# EAGLE schematic esquema (EAGLE 9.6.2)
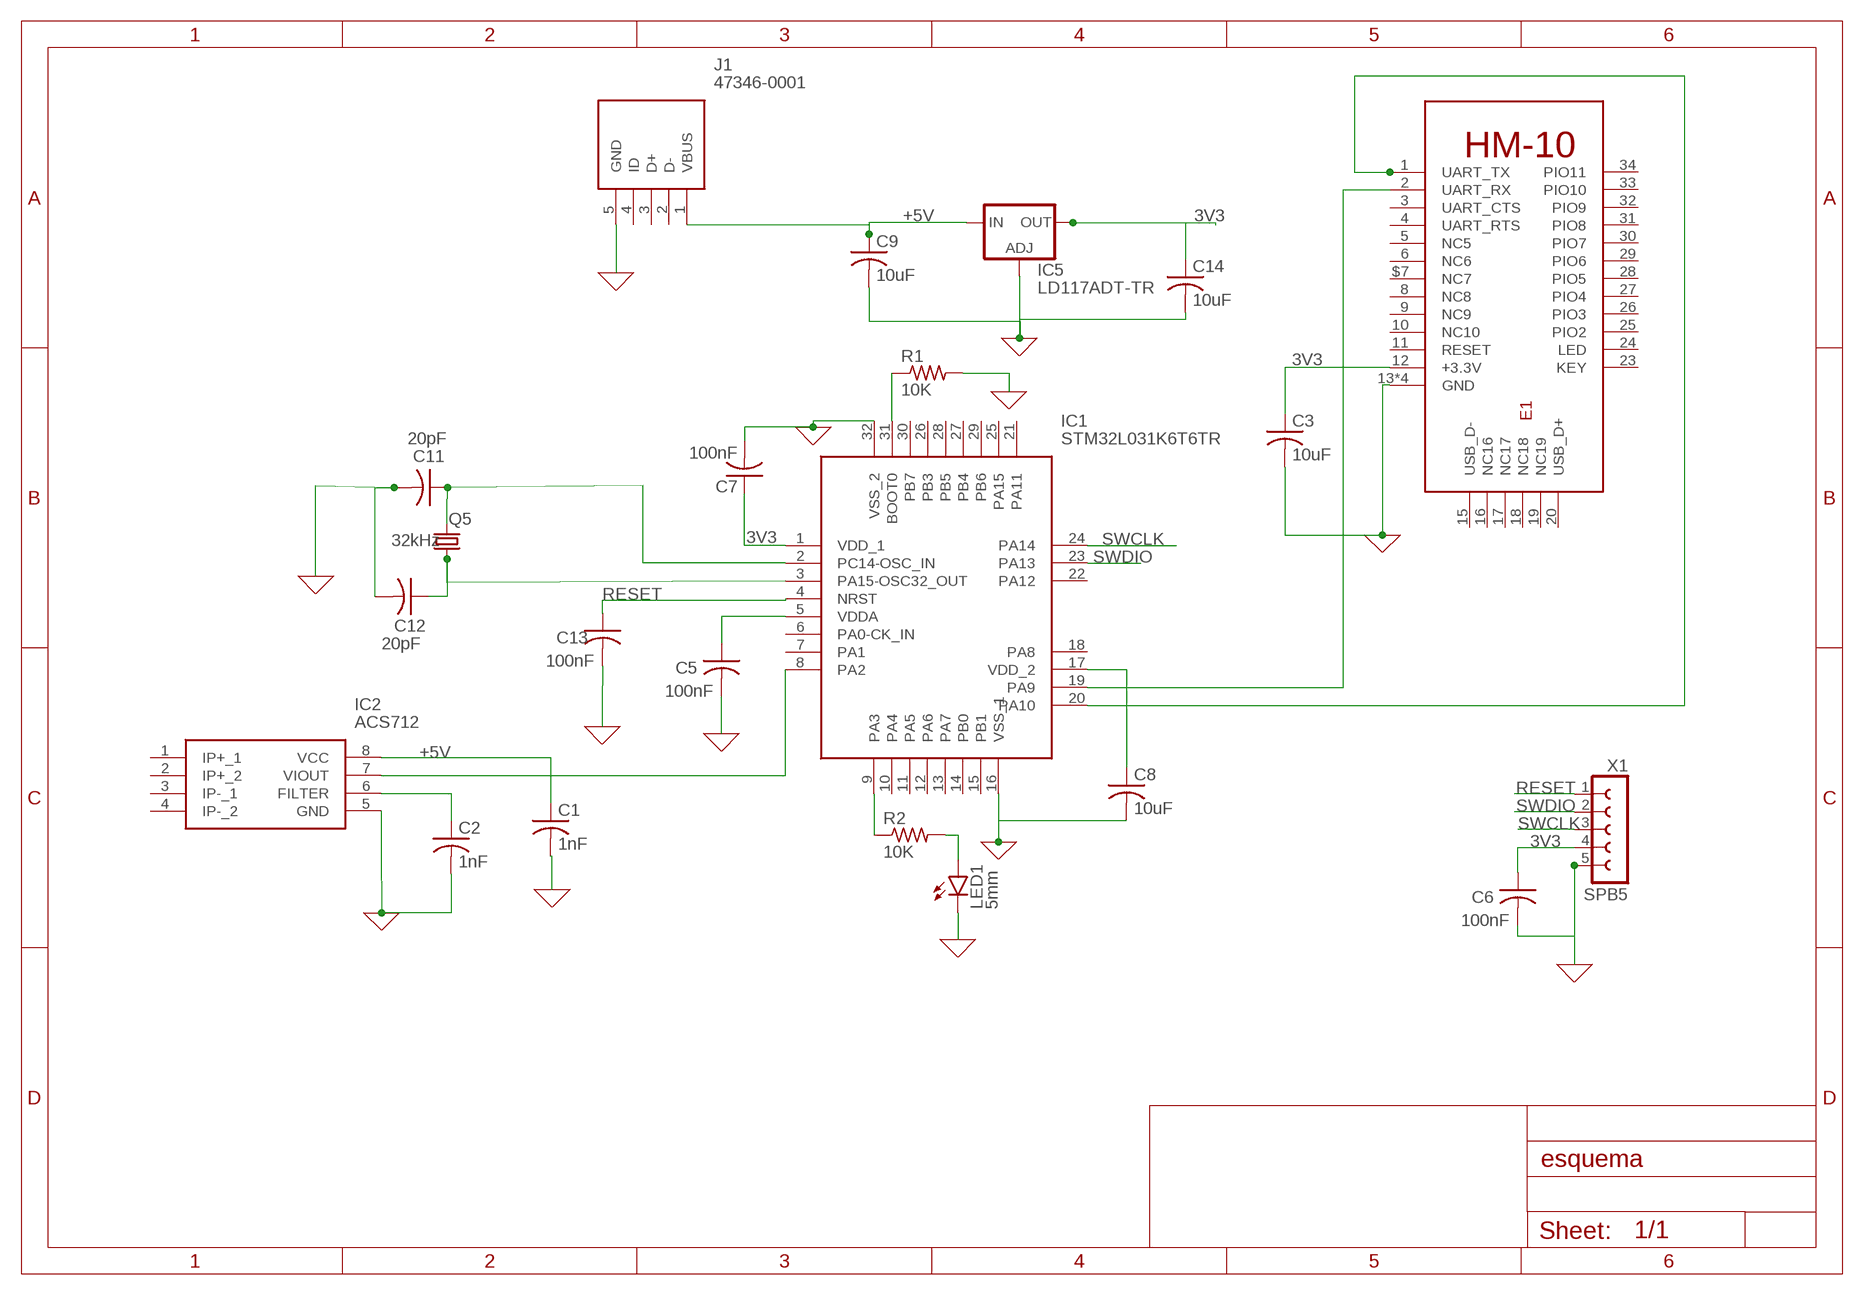
[diagram p0: schematic, sheet 1]

## Parts
C1  1nF  C-USC0805  [C0805]
C2  1nF  C-USC0805  [C0805]
C3  10uF  C-USC0805  [C0805]
C5  100nF  C-USC0805  [C0805]
C6  100nF  C-USC0805  [C0805]
C7  100nF  C-USC0805  [C0805]
C8  10uF  C-USC0805  [C0805]
C9  10uF  C-USC0805  [C0805]
C11  20pF  C-USC0805  [C0805]
C12  20pF  C-USC0805  [C0805]
C13  100nF  C-USC0805  [C0805]
C14  10uF  C-USC0805  [C0805]
E1  HM-10-BOARD  [26.9X13X2.2_BOARD]
IC1  STM32L031K6T6TR  [QFP80P900X900X160-32N]
IC2  ACS712  [SOIC127P600X175-8N]
IC5  LD117ADT-TR  [DPACK]
J1  47346-0001  [47346-0001]
LED1  5mm  LED5MM  [LED5MM]
Q5  32kHz  CRYSTALHC49S  [HC49/S]
R1  10K  R-US_1812X7R  [1812X7R]
R2  10K  R-US_1812X7R  [1812X7R]
X1  SPB5  [SPB5]

## Nets
0: C1.2 C2.2 C3.2 C5.2 C6.2 C7.2 C8.2 C9.2 C11.2 C12.2 C13.2 C14.2 E1.13(GND) E1.14(GND) E1.21(GND) E1.22(GND) IC1.16(VSS_1) IC1.32(VSS_2) IC2.5(GND) IC5.1(ADJ) J1.5(GND) LED1.K(C) R1.2 X1.5 ; supply symbol labelled GND
3V3: C14.1 IC5.4(OUT)
+5V: C9.1 IC5.3(IN) J1.1(VBUS)
N$1: IC1.8(PA2) IC2.7(VIOUT)
N$2: C11.1 IC1.2(PC14-OSC_IN) Q5.2
N$3: IC1.31(BOOT0) R1.1
N$4: C1.1 IC2.8(VCC)
N$5: C12.1 IC1.3(PA15-OSC32_OUT) Q5.1
N$6: IC1.23(PA13)
N$7: E1.2(UART_RX) IC1.19(PA9)
N$8: C13.1 IC1.4(NRST)
N$9: C2.1 IC2.6(FILTER)
N$10: C3.1 E1.12(+3.3V)
N$11: IC1.9(PA3) R2.1
N$12: C7.1 IC1.1(VDD_1)
N$13: C6.1 X1.4
N$14: C8.1 IC1.17(VDD_2)
N$15: LED1.A R2.2
N$16: C5.1 IC1.5(VDDA)
N$17: E1.1(UART_TX) IC1.20(PA10)
N$18: IC1.24(PA14)
RESET: X1.1
SWCLK: X1.3
SWDIO: X1.2
Unconnected: E1.3(UART_CTS) E1.4(UART_RTS) E1.5(NC5) E1.6(NC6) E1.8(NC8) E1.9(NC9) E1.10(NC10) E1.11(RESET) E1.15(USB_D-) E1.16(NC16) E1.17(NC17) E1.18(NC18) E1.19(NC19) E1.20(USB_D+) E1.23(KEY) E1.24(LED) E1.25(PIO2) E1.26(PIO3) E1.27(PIO4) E1.28(PIO5) E1.29(PIO6) E1.30(PIO7) E1.31(PIO8) E1.32(PIO9) E1.33(PIO10) E1.34(PIO11) E1.$7(NC7) IC1.6(PA0-CK_IN) IC1.7(PA1) IC1.10(PA4) IC1.11(PA5) IC1.12(PA6) IC1.13(PA7) IC1.14(PB0) IC1.15(PB1) IC1.18(PA8) IC1.21(PA11) IC1.22(PA12) IC1.25(PA15) IC1.26(PB3) IC1.27(PB4) IC1.28(PB5) IC1.29(PB6) IC1.30(PB7) IC2.1(IP+_1) IC2.2(IP+_2) IC2.3(IP-_1) IC2.4(IP-_2) J1.2(D-) J1.3(D+) J1.4(ID)

## Library data of the parts
C1-C3 C5-C9 C11-C14 = rcl:C-US: CAPACITOR, American symbol; SPICEPREFIX: C
E1 = hm10:HM-10: HM Bluetooth module use TI CC2540 or CC2541, Master and slave roles in one, transmission version and remote control version and PIO state acquisition functions in one, Support the AT command modify module parameters, Convenient and flexible.
IC1 = STM32L031K6T6TR:STM32L031K6T6TR: STMICROELECTRONICS - STM32L031K6T6TR - ARM MCU, STM32 Family STM32L0 Series Microcontrollers, ARM Cortex-M0+, 32bit, 32 MHz, 32 KB, 8 KB Source: Datasheet <https://4donline.ihs.com/images/VipMasterIC/IC/SGST/SGST-S-A0002219924/SGST-S-A0002219924-1.pdf?hkey=6D3A4C79FDBF58556ACFDE234799DDF0>; ARROW_PART_NUMBER: STM32L031K6T6TR; ARROW_PRICE-STOCK: https://www.arrow.com/en/products/stm32l031k6t6tr/stmicroelectronics; DESCRIPTION: STMICROELECTRONICS - STM32L031K6T6TR - ARM MCU, STM32 Family STM32L0 Series Microcontrollers, ARM Cortex-M0+, 32bit, 32 MHz, 32 KB, 8 KB; HEIGHT: 1.6mm; MANUFACTURER_NAME: STMicroelectronics; MANUFACTURER_PART_NUMBER: STM32L031K6T6TR; MOUSER_PART_NUMBER: 511-STM32L031K6T6TR; MOUSER_PRICE-STOCK: https://www.mouser.co.uk/ProductDetail/STMicroelectronics/STM32L031K6T6TR/?qs=xwQlLnDx56Cmxri8cgW0QQ%3D%3D
IC2 = ACS712:ACS712: Fully Integrated, Hall Effect-Based Linear Current Sensor IC with 2.1 kVRMS Isolation and a Low-Resistance Current Conductor Source: Datasheet <https://www.allegromicro.com/~/media/files/datasheets/acs712-datasheet.ashx>; DESCRIPTION: Fully Integrated, Hall Effect-Based Linear Current Sensor IC with 2.1 kVRMS Isolation and a Low-Resistance Current Conductor; HEIGHT: 1.75mm; MANUFACTURER_NAME: Allegro Microsystems; MANUFACTURER_PART_NUMBER: ACS712
IC5 = v-reg:LD117A?*: Low drop fixed and adjustable positive voltage regulators 1 A Source: http://www.st.com/stonline/products/literature/ds/7194/ld1117axx.pdf
J1 = 47346-0001:47346-0001: Micro USB B Receptacle Bottom Mount Assy Molex Right Angle SMT Type B Version 2.0 Micro USB Connector Socket, 30 V ac, 1A 47352 MICRO-USB Source: Datasheet <http://www.molex.com/pdm_docs/sd/473460001_sd.pdf>; DESCRIPTION: Micro USB B Receptacle Bottom Mount Assy Molex Right Angle SMT Type B Version 2.0 Micro USB Connector Socket, 30 V ac, 1A 47352 MICRO-USB; HEIGHT: mm; MANUFACTURER_NAME: Molex; MANUFACTURER_PART_NUMBER: 47346-0001; MOUSER_PART_NUMBER: 538-47346-0001; MOUSER_PRICE-STOCK: https://www.mouser.co.uk/ProductDetail/Molex/47346-0001?qs=c2CV6XM0DweJBWaSeyWeCw%3D%3D
LED1 = led:LED: LED OSRAM: - CHIPLED LG R971, LG N971, LY N971, LG Q971, LY Q971, LO R971, LY R971 LH N974, LH R974 LS Q976, LO Q976, LY Q976 LO Q996 - Hyper CHIPLED LW Q18S LB Q993, LB Q99A, LB R99A - SideLED LS A670, LO A670, LY A670, LG A670, LP A670 LB A673, LV A673, LT A673, LW A673 LH A674 LY A675 LS A676, LA A676, LO A676, LY A676, LW A676 LS A679, LY A679, LG A679 - Hyper Micro SIDELED® LS Y876, LA Y876, LO Y876, LY Y876 LT Y87S - SmartLED LW L88C, LW L88S LB L89C, LB L89S, LG L890 LS L89K, LO L89K, LY L89K LS L896, LA L896, LO L896, LY L896 - TOPLED LS T670, LO T670, LY T670, LG T670, LP T670 LSG T670, LSP T670, LSY T670, LOP T670, LYG T670 LG T671, LOG T671, LSG T671 LB T673, LV T673, LT T673, LW T673 LH T674 LS T676, LA T676, LO T676, LY T676, LB T676, LH T676, LSB T676, LW T676 LB T67C, LV T67C, LT T67C, LS T67K, LO T67K, LY T67K, LW E67C LS E67B, LA E67B, LO E67B, LY E67B, LB E67C, LV E67C, LT E67C LW T67C LS T679, LY T679, LG T679 LS T770, LO T770, LY T770, LG T770, LP T770 LB T773, LV T773, LT T773, LW T773 LH T774 LS E675, LA E675, LY E675, LS T675 LS T776, LA T776, LO T776, LY T776, LB T776 LHGB T686 LT T68C, LB T68C - Hyper Mini TOPLED® LB M676 - Mini TOPLED Santana® LG M470 LS M47K, LO M47K, LY M47K Source: http://www.osram.convergy.de LUXEON: - LUMILED® LXK2-PW12-R00, LXK2-PW12-S00, LXK2-PW14-U00, LXK2-PW14-V00 LXK2-PM12-R00, LXK2-PM12-S00, LXK2-PM14-U00 LXK2-PE12-Q00, LXK2-PE12-R00, LXK2-PE12-S00, LXK2-PE14-T00, LXK2-PE14-U00 LXK2-PB12-K00, LXK2-PB12-L00, LXK2-PB12-M00, LXK2-PB14-N00, LXK2-PB14-P00, LXK2-PB14-Q00 LXK2-PR12-L00, LXK2-PR12-M00, LXK2-PR14-Q00, LXK2-PR14-R00 LXK2-PD12-Q00, LXK2-PD12-R00, LXK2-PD12-S00 LXK2-PH12-R00, LXK2-PH12-S00 LXK2-PL12-P00, LXK2-PL12-Q00, LXK2-PL12-R00 Source: www.luxeon.com KINGBRIGHT: KA-3528ASYC Source: www.kingbright.com
Q5 = crystal:CRYSTAL: CRYSTAL; OC_FARNELL: 1667008; OC_NEWARK: unknown
R1 R2 = rcl:R-US_: RESISTOR, American symbol; SPICEPREFIX: R
X1 = con-hirschmann:SPB5: CONNECTOR 5 pins; OC_FARNELL: unknown; OC_NEWARK: unknown